# EAGLE design uduino-v1_1 (EAGLE 6.5.0)
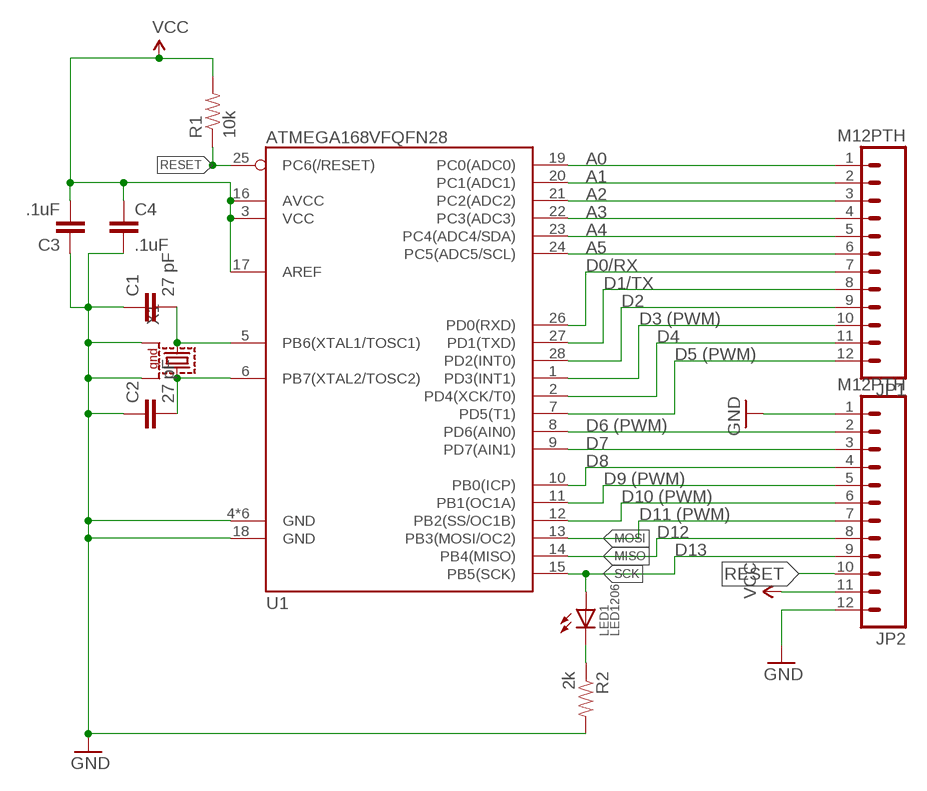
[diagram p0: schematic, sheet 1]

## Parts
C1  27 pF  CAPCAP-0603  [CAP-0603]
C2  27 pF  CAPCAP-0603  [CAP-0603]
C3  .1uF  CAPCAP-0603  [CAP-0603]
C4  .1uF  CAPCAP-0603  [CAP-0603]
JP1  M12PTH  [1X12]
JP2  M12PTH  [1X12]
LED1  LED1206  [LED-1206]
R1  10k  RESISTOR0603  [RES-0603]
R2  2k  RESISTOR0603  [RES-0603]
U1  ATMEGA168VFQFN28  ATMEGA168-28PINVFQFN-28  [VQFN28]
X1  CRYSTAL-SMD-7B-SERIES-TXC  [CRYSTAL-SMD-7B-SERIES-5X3.2MM]

## Nets
GND: C1.1 C2.1 C3.1 C4.2 JP2.1 JP2.12 R2.2 U1.4(GND) U1.18(GND) U1.TH(GND) U1.TH@1(GND) U1.TH@2(GND) U1.TH@3(GND) U1.TH@4(GND) X1.P$2 X1.P$4
MISO: JP2.8 U1.14(PB4(MISO))
MOSI: JP2.7 U1.13(PB3(MOSI/OC2))
N$1: C1.2 U1.5(PB6(XTAL1/TOSC1)) X1.P$1
N$2: C2.2 U1.6(PB7(XTAL2/TOSC2)) X1.P$3
N$3: LED1.C R2.1
N$4: JP2.2 U1.8(PD6(AIN0))
N$5: JP2.3 U1.9(PD7(AIN1))
N$6: JP1.1 U1.19(PC0(ADC0))
N$7: JP1.2 U1.20(PC1(ADC1))
N$8: JP1.3 U1.21(PC2(ADC2))
N$9: JP1.4 U1.22(PC3(ADC3))
N$10: JP1.5 U1.23(PC4(ADC4/SDA))
N$11: JP1.6 U1.24(PC5(ADC5/SCL))
N$12: JP1.7 U1.26(PD0(RXD))
N$13: JP1.8 U1.27(PD1(TXD))
N$14: JP1.9 U1.28(PD2(INT0))
N$15: JP1.10 U1.1(PD3(INT1))
N$16: JP1.11 U1.2(PD4(XCK/T0))
N$17: JP1.12 U1.7(PD5(T1))
N$20: JP2.4 U1.10(PB0(ICP))
N$21: JP2.5 U1.11(PB1(OC1A))
N$22: JP2.6 U1.12(PB2(SS/OC1B))
RESET: JP2.10 R1.1 U1.25(PC6(/RESET))
SCK: JP2.9 LED1.A U1.15(PB5(SCK))
VCC: C3.2 C4.1 JP2.11 R1.2 U1.3(VCC) U1.16(AVCC) U1.17(AREF)

## Notes on the sheet
- A0
- A1
- A2
- A3
- A4
- A5
- D0/RX
- D1/TX
- D2
- D3 (PWM)
- D4
- D5 (PWM)
- D6 (PWM)
- D7
- D8
- D9 (PWM)
- D10 (PWM)
- D11 (PWM)
- D12
- D13

## Library data of the parts
C1-C4 = LITTLEBITS140915:CAP
JP1 JP2 = SparkFun-Connectors:M12: Header 12 Standard 12-pin 0.1" header. Use with straight break away headers (SKU : PRT-00116), right angle break away headers (PRT-00553), swiss pins (PRT-00743), machine pins (PRT-00117), and female headers (PRT-00115).
LED1 = LITTLEBITS140915:LED
R1 R2 = LITTLEBITS140915:RESISTOR
U1 = uduino:ATMEGA168-28PIN
X1 = LITTLEBITS140915:CRYSTAL-SMD-7B-SERIES-TXC; MFG: TXC; MPN: 7B SERIES

## Board
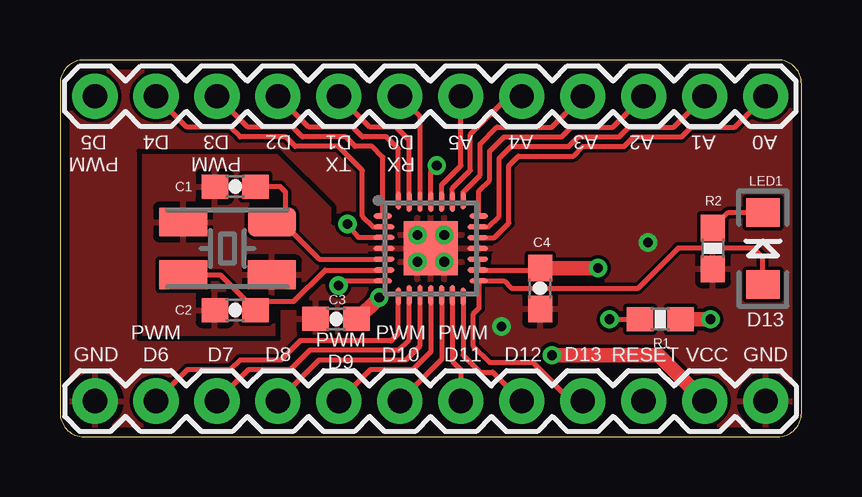
[diagram p1: board, top side]
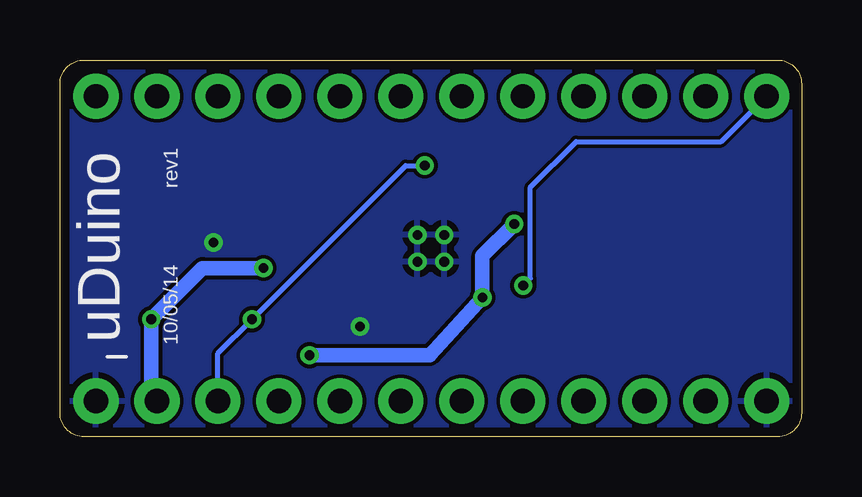
[diagram p2: board, bottom side, seen from below]

Size 30.9 x 15.7 mm. Coordinates in mm from the lower left corner, seen from the top.
Outline: 0,14.7 0,1 arc90 1,0 29.9,0 arc90 30.9,1 30.9,14.7 arc90 29.9,15.7 1,15.7 arc90 0,14.7
Copper layers (1*16): Top 0.0356mm / dielectric 1.5011mm / Bottom 0.0356mm
Design rules "LaenPCBOrder": minimum track width 6mil, minimum drill 13mil, track to track 6mil, track to pad 6mil, pad to pad 6mil, via to via 6mil, smd to smd 6mil, copper to edge 15mil, drill to drill 6mil, minimum pad ring 7mil, minimum via ring 7mil, stop-mask expansion 3mil, vias tented up to drill 0mil, thermal gap 10mil
tRestrict: 8 lines

### Footprints (pad centres in the part's own frame; a part is rotated, then mirrored left to right if it is on the bottom)
CAP-0603 = smd 1.1 x 1: 1 -0.85,0; 2 0.85,0
1X12 = drill 1.016 pad 1.88: 1 0,0; 2 2.54,0; 3 5.08,0; 4 7.62,0; 5 10.16,0; 6 12.7,0; 7 15.24,0; 8 17.78,0; 9 20.32,0; 10 22.86,0; 11 25.4,0; 12 27.94,0
LED-1206 = smd 1.2 x 1.4: A -1.5,0; C 1.5,0
RES-0603 = smd 1.1 x 1: 1 -0.85,0; 2 0.85,0
VQFN28 = smd 0.75 x 0.2: 1 -2,1.35; 7 -2,-1.35; 15 2,-1.35; 21 2,1.35 | smd 0.85 x 0.2: 2 -1.95,0.9; 3 -1.95,0.455; 4 -1.95,0; 5 -1.95,-0.45; 6 -1.95,-0.9; 16 1.95,-0.9; 17 1.95,-0.45; 18 1.95,0; 19 1.95,0.45; 20 1.95,0.9 | smd 0.2 x 0.75: 8 -1.35,-2; 14 1.35,-2; 22 1.35,2; 28 -1.35,2 | smd 0.2 x 0.85: 9 -0.9,-1.95; 10 -0.45,-1.95; 11 0,-1.95; 12 0.45,-1.95; 13 0.9,-1.95; 23 0.9,1.95; 24 0.45,1.95; 25 0,1.95; 26 -0.45,1.95; 27 -0.9,1.95 | smd 2.25 x 2.25: TH 0,0 | drill 0.406 pad 0.406: TH@1 -0.559,0.559; TH@2 0.559,0.559; TH@3 -0.559,-0.559; TH@4 0.559,-0.559
CRYSTAL-SMD-7B-SERIES-5X3.2MM = smd 2 x 1.2: P$1 -1.85,-1.1; P$2 1.85,-1.1; P$3 1.85,1.1; P$4 -1.85,1.1

### Placement (x,y rotation side)
C1  7.3,10.42 0 top
C2  7.3,5.28 0 top
C3  11.5,4.91 0 top
C4  20,6.18 270 top
JP1  29.4,14.19 180 top
JP2  1.46,1.49 0 top
LED1  29.29,7.85 90 top
R1  25.01,4.9 0 top
R2  27.2,7.85 270 top
U1  15.45,7.85 0 top
X1  6.98,7.85 180 top

### Tracks (layer width: path | path; a pad name or v marks a point on that pad's centre or on a via)
GND  (via drill 0.41)
  other vias: 24.5,8.1 18.4,4.6
  pour Top: 29.9,0 1,0 arc-90 0,1 0,14.7 arc-90 1,15.7 29.9,15.7 arc-90 30.9,14.7 30.9,1 arc-90
  pour Bottom: 29.9,0 1,0 arc-90 0,1 0,14.7 arc-90 1,15.7 29.9,15.7 arc-90 30.9,14.7 30.9,1 arc-90
MISO
  Top 0.2: JP2.8 18.03,2.7 17.5,2.7 16.8,3.4 U1.14
MOSI
  Top 0.2: JP2.7 16.7,2.8 16.35,3.15 U1.13
N$1
  Top 0.2: X1.P$1 9.4,9.22 | 9.4,9.22 9.4,10.2 9.18,10.42 C1.2 | 9.4,9.22 9.5,9.12 9.5,8.7 10.8,7.4 U1.5
N$2
  Top 0.2: 8.02,5.48 C2.2 | X1.P$3 6.68,6.75 C2.2 | C2.2 8.31,5.44 8.31,5.64 9.74,5.64 11.05,6.95 U1.6
N$3
  Top 0.2: R2.1 27.85,9.35 LED1.C
N$4
  Top 0.2: JP2.2 5.31,2.8 7.1,2.8 7.5,3.2 9.2,3.2 10,4 13.8,4 14.1,4.3 U1.8
N$5
  Top 0.2: JP2.3 7.85,2.8 9.6,2.8 10.4,3.6 14.1,3.6 14.55,4.05 U1.9
N$6
  Top 0.2: JP1.1 28.11,12.9 26.3,12.9 25.9,12.5 23.9,12.5 23.5,12.1 21.8,12.1 21.4,11.7 19.1,11.7 18.7,11.3 18.7,8.9 18.1,8.3 U1.19
N$7
  Top 0.2: JP1.2 25.57,12.9 23.7,12.9 23.3,12.5 21.6,12.5 21.2,12.1 18.8,12.1 18.3,11.6 18.3,9.2 17.85,8.75 U1.20
N$8
  Top 0.2: JP1.3 23.03,12.9 21.3,12.9 20.9,12.5 18.5,12.5 17.9,11.9 17.9,10.7 17.45,10.25 U1.21
N$9
  Top 0.2: JP1.4 20.49,12.9 18.2,12.9 17.5,12.2 17.5,10.9 16.8,10.2 U1.22
N$10
  Top 0.2: JP1.5 18.69,14.19 17.1,12.6 17.1,11.1 16.35,10.35 U1.23
N$11
  Top 0.2: JP1.6 16.7,11.3 15.9,10.5 U1.24
N$12
  Top 0.2: JP1.7 15,13.35 U1.26
N$13
  Top 0.2: JP1.8 12.91,12.9 14,12.9 14.55,12.35 U1.27
N$14
  Top 0.2: JP1.9 10.37,12.9 12.2,12.9 12.6,12.5 13.6,12.5 14.1,12 U1.28
N$15
  Top 0.2: JP1.10 7.83,12.9 9.7,12.9 10.1,12.5 11.9,12.5 12.3,12.1 13,12.1 13.45,11.65 U1.1
N$16
  Top 0.2: JP1.11 5.29,12.9 7.1,12.9 7.5,12.5 9.4,12.5 9.8,12.1 11.6,12.1 12.6,11.1 12.6,9.2 13.05,8.75 U1.2
N$17  (via drill 0.41)
  Top 0.2: v11.6,6.3 11.8,6.5 U1.7
  Bottom 0.2: v11.6,6.3 11.3,6.6 11.3,10.4 9.4,12.3 3.35,12.3 JP1.12
N$20
  Top 0.2: JP2.4 10.79,3.2 14.4,3.2 15,3.8 U1.10
N$21
  Top 0.2: JP2.5 12.93,2.8 14.7,2.8 15.45,3.55 U1.11
N$22
  Top 0.2: 14.19,1.49 JP2.6 15.9,3.23 U1.12
RESET  (via drill 0.41)
  Top 0.2: v22.9,4.9 R1.1 | U1.25 15.45,11.05 v15.7,11.3
  Bottom 0.2: JP2.10 24.32,3.48 v22.9,4.9 16.5,11.3 v15.7,11.3
SCK
  Top 0.2: LED1.A 29.29,7.46 28.89,7.86 25.76,7.86 24.1,6.2 18.8,6.2 18.5,6.5 U1.15 17.45,5.35 17.2,5.1 17.2,3.8 17.9,3.1 19.7,3.1 21.31,1.49 JP2.9
VCC  (via drill 0.41)
  Top 0.2: U1.17 U1.16 19.92,6.95 C4.1 19.98,7.01 | v11.97,8.87 12.38,8.37 12.44,8.3 U1.3
  Top 0.61: C4.1 v22.42,7.03 | v20.5,3.4 24.95,3.4 JP2.11 | C3.2 12.41,4.91 v13.3,5.8 | R1.2 v27.1,4.9
  Bottom 0.61: v20.5,3.4 15.5,3.4 v13.3,5.8 13.3,7.54 v11.97,8.87 | JP2.11 27.1,1.73 v27.1,4.9 24.97,7.03 v22.42,7.03

### Text on the board
tPlace: PWM / D5 | D4 | PWM / D3 | D2 | TX / D1 | RX / D0 | A5 | A4 | A3 | A2 | A1 | A0 | D13 | PWM / D6 | PWM / D9 | PWM / D10 | PWM / D11 | GND | D7 | D8 | D12 | D13 | RESET | VCC | GND
bPlace: rev1 | uDuino | 10/05/14